# EAGLE schematic driver-ha-v4 (EAGLE 6.5.0)
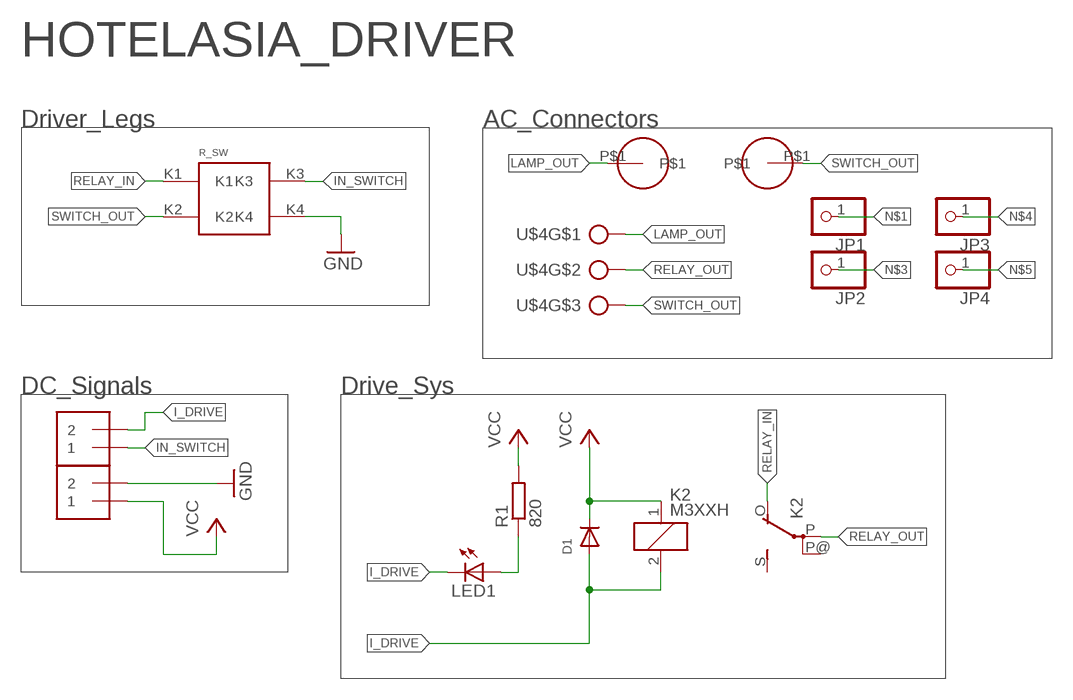
[diagram p0: schematic, sheet 1]

## Parts
D1  DIODESMA  [SMADIODE]
J1  1X2-3.5MM  [1X2-3.5MM]
J2  1X2-3.5MM  [1X2-3.5MM]
JP1  PINHD-1X1  [1X01]
JP2  PINHD-1X1  [1X01]
JP3  PINHD-1X1  [1X01]
JP4  PINHD-1X1  [1X01]
K2  M3XXH  [M3XXH]
LED1  LEDCHIPLED_0805  [CHIPLED_0805]
PAD1  ROOM_SWITCH  [ROOM_SWITCH]
R1  820  R-EU_R0805  [R0805]
U$1  CONN-CABLE  [CONN-CABLE]
U$3  CONN-CABLE  [CONN-CABLE]
U$4  AK3003  [AK3003]

## Nets
GND: J2.2 PAD1.K4
I_DRIVE: D1.A J1.2 K2.2 LED1.C
IN_SWITCH: J1.1 PAD1.K3
LAMP_OUT: U$1.P$1 U$4.1
N$1: JP1.1
N$2: LED1.A R1.1
N$3: JP2.1
N$4: JP3.1
N$5: JP4.1
RELAY_IN: K2.O(2:O) PAD1.K1
RELAY_OUT: K2.P(2:P) U$4.2
SWITCH_OUT: PAD1.K2 U$3.P$1 U$4.3
VCC: D1.C J2.1 K2.1 R1.2
Unconnected: K2.P@(2:P) K2.S(2:S)

## Notes on the sheet
- HOTELASIA_DRIVER
- Driver_Legs | AC_Connectors
- DC_Signals | Drive_Sys

## Library data of the parts
D1 = adafruit:DIODE: Diode SMADIODE - SMA Surface Mount Package 20V 1A Schottky Diode Digikey: 641-1014-6-ND DO-1N4148 - Through Hole Small Current Diode SOD-123 20V 1 A (.5mV Vf) Schottky Diode - Digikey: MBRX120TPMSCT-ND SOD-323 10V 570mA (.38mV Vf, 3ns) Schottky Diode - Digikey: ZLLS410CT-ND SOD-523 30V 30mA Schottky Diode (RB751S-40TE61) - Digikey: RB751S-40TE61CT-ND SOT23-R/W - SOT23 Package (R = Solder Paste/Reflow Ovens, W = Hand-Soldering) BAT54Film 40V 300mA - Digikey: 497-7162-1-ND
J1 J2 = adafruit:1X2: 3.5mm Terminal block http://www.ladyada.net/library/pcb/eaglelibrary.html
JP1-JP4 = pinhead:PINHD-1X1: PIN HEADER
K2 = relay:M3XXH: RELAY 1 x switch; OC_FARNELL: unknown; OC_NEWARK: unknown
LED1 = adafruit:LED: LED OSRAM: - CHIPLED LG R971, LG N971, LY N971, LG Q971, LY Q971, LO R971, LY R971 LH N974, LH R974 LS Q976, LO Q976, LY Q976 LO Q996 - Hyper CHIPLED LW Q18S LB Q993, LB Q99A, LB R99A - SideLED LS A670, LO A670, LY A670, LG A670, LP A670 LB A673, LV A673, LT A673, LW A673 LH A674 LY A675 LS A676, LA A676, LO A676, LY A676, LW A676 LS A679, LY A679, LG A679 - Hyper Micro SIDELED® LS Y876, LA Y876, LO Y876, LY Y876 LT Y87S - SmartLED LW L88C, LW L88S LB L89C, LB L89S, LG L890 LS L89K, LO L89K, LY L89K LS L896, LA L896, LO L896, LY L896 - TOPLED LS T670, LO T670, LY T670, LG T670, LP T670 LSG T670, LSP T670, LSY T670, LOP T670, LYG T670 LG T671, LOG T671, LSG T671 LB T673, LV T673, LT T673, LW T673 LH T674 LS T676, LA T676, LO T676, LY T676, LB T676, LH T676, LSB T676, LW T676 LB T67C, LV T67C, LT T67C, LS T67K, LO T67K, LY T67K, LW E67C LS E67B, LA E67B, LO E67B, LY E67B, LB E67C, LV E67C, LT E67C LW T67C LS T679, LY T679, LG T679 LS T770, LO T770, LY T770, LG T770, LP T770 LB T773, LV T773, LT T773, LW T773 LH T774 LS E675, LA E675, LY E675, LS T675 LS T776, LA T776, LO T776, LY T776, LB T776 LHGB T686 LT T68C, LB T68C - Hyper Mini TOPLED® LB M676 - Mini TOPLED Santana® LG M470 LS M47K, LO M47K, LY M47K Source: http://www.osram.convergy.de/
PAD1 = maul:ROOM_SWITCH
R1 = resistor:R-EU_: RESISTOR, European symbol
U$1 U$3 = bontor:CONN-CABLE
U$4 = con-ptr500:AK3003

## Net classes
0 default: width 0.305 mm, drill 0.508 mm, clearance 5.08 mm